# Altium schematic sheet Power-Supply.SchDoc
size A4; SheetNumber: 1; SheetTotal: 6
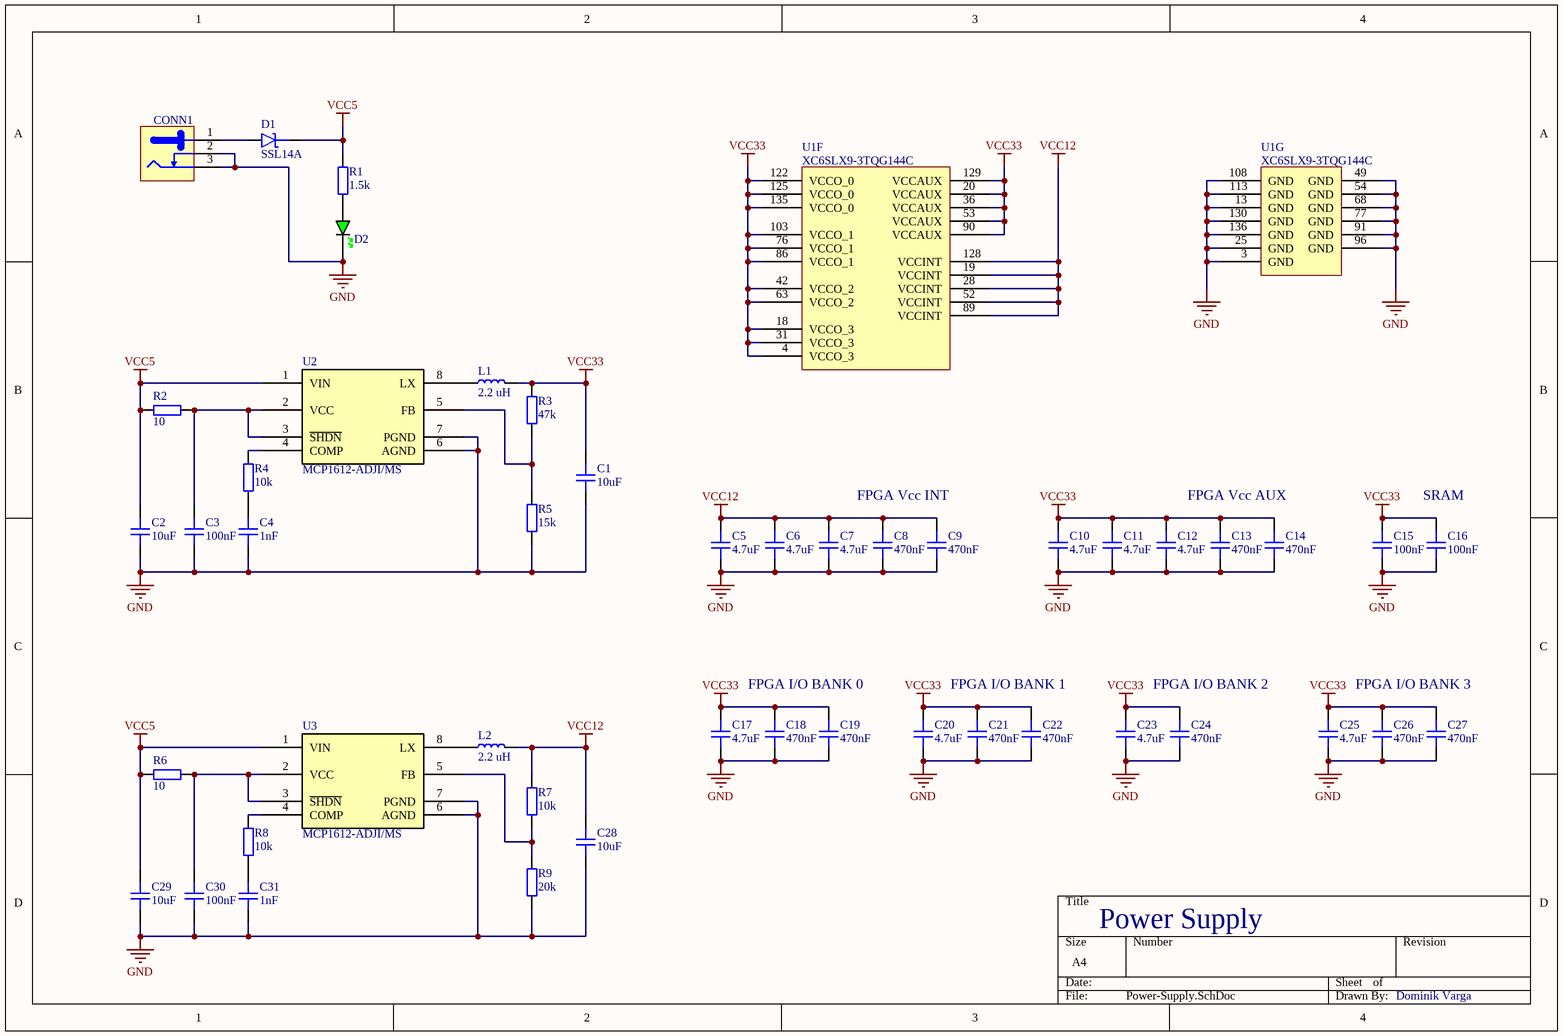
[diagram p0: Power-Supply.SchDoc]

## Parts
C1  10uF  [CAP_SMD1210]
C2  10uF  [CAP_SMD1210]
C3  100nF  [CAP_SMD0603]
C4  1nF  [CAP_SMD0603]
C5  4.7uF  [CAP_SMD0603]
C6  4.7uF  [CAP_SMD0603]
C7  4.7uF  [CAP_SMD0603]
C8  470nF  [CAP_SMD0603]
C9  470nF  [CAP_SMD0603]
C10  4.7uF  [CAP_SMD0603]
C11  4.7uF  [CAP_SMD0603]
C12  4.7uF  [CAP_SMD0603]
C13  470nF  [CAP_SMD0603]
C14  470nF  [CAP_SMD0603]
C15  100nF  [CAP_SMD0603]
C16  100nF  [CAP_SMD0603]
C17  4.7uF  [CAP_SMD0603]
C18  470nF  [CAP_SMD0603]
C19  470nF  [CAP_SMD0603]
C20  4.7uF  [CAP_SMD0603]
C21  470nF  [CAP_SMD0603]
C22  470nF  [CAP_SMD0603]
C23  4.7uF  [CAP_SMD0603]
C24  470nF  [CAP_SMD0603]
C25  4.7uF  [CAP_SMD0603]
C26  470nF  [CAP_SMD0603]
C27  470nF  [CAP_SMD0603]
C28  10uF  [CAP_SMD1210]
C29  10uF  [CAP_SMD1210]
C30  100nF  [CAP_SMD0603]
C31  1nF  [CAP_SMD0603]
CONN1  DC_PWR  [DC_PWR_CONN]  (value not drawn)
D1  SSL14A  [DIOM5226X230N]
D2  GREEN  [LED_G_SMD0603]  (value not drawn)
L1  2.2 uH  [SDR0604]
L2  2.2 uH  [SDR0604]
R1  1.5k  [RES_SMD0603]
R2  10  [RES_SMD0603]
R3  47k  [RES_SMD0603]
R4  10k  [RES_SMD0603]
R5  15k  [RES_SMD0603]
R6  10  [RES_SMD0603]
R7  10k  [RES_SMD0603]
R8  10k  [RES_SMD0603]
R9  20k  [RES_SMD0603]
U1  XC6SLX9-3TQG144C  [QFP50P2200X2200X160-144N]  (parts F,G of 7)
U2  MCP1612-ADJI/MS  [SOP65P490X109-8N]
U3  MCP1612-ADJI/MS  [SOP65P490X109-8N]

## Nets
GND: C1.1 C2.1 C3.1 C4.1 C5.1 C6.1 C7.1 C8.1 C9.1 C10.1 C11.1 C12.1 C13.1 C14.1 C15.1 C16.1 C17.1 C18.1 C19.1 C20.1 C21.1 C22.1 C23.1 C24.1 C25.1 C26.1 C27.1 C28.1 C29.1 C30.1 C31.1 CONN1.2 CONN1.3 D2.2(K) R5.1 R9.1 U1.3(GND) U1.13(GND) U1.25(GND) U1.49(GND) U1.54(GND) U1.68(GND) U1.77(GND) U1.91(GND) U1.96(GND) U1.108(GND) U1.113(GND) U1.130(GND) U1.136(GND) U2.6(AGND) U2.7(PGND) U3.6(AGND) U3.7(PGND)
VCC5: C2.2 C29.2 D1.1(K) R1.2 R2.1 R6.1 U2.1(VIN) U3.1(VIN)
VCC12: C5.2 C6.2 C7.2 C8.2 C9.2 C28.2 L2.2 R7.2 U1.19(VCCINT) U1.28(VCCINT) U1.52(VCCINT) U1.89(VCCINT) U1.128(VCCINT)
VCC33: C1.2 C10.2 C11.2 C12.2 C13.2 C14.2 C15.2 C16.2 C17.2 C18.2 C19.2 C20.2 C21.2 C22.2 C23.2 C24.2 C25.2 C26.2 C27.2 L1.2 R3.2 U1.4(VCCO_3) U1.18(VCCO_3) U1.20(VCCAUX) U1.31(VCCO_3) U1.36(VCCAUX) U1.42(VCCO_2) U1.53(VCCAUX) U1.63(VCCO_2) U1.76(VCCO_1) U1.86(VCCO_1) U1.90(VCCAUX) U1.103(VCCO_1) U1.122(VCCO_0) U1.125(VCCO_0) U1.129(VCCAUX) U1.135(VCCO_0)
NetC3_2: C3.2 R2.2 U2.2(VCC) U2.3(~{SHDN})
NetC4_2: C4.2 R4.1
NetC30_2: C30.2 R6.2 U3.2(VCC) U3.3(~{SHDN})
NetC31_2: C31.2 R8.1
NetCONN1_1: CONN1.1 D1.2(A)
NetD2_1: D2.1(A) R1.1
NetL1_1: L1.1 U2.8(LX)
NetL2_1: L2.1 U3.8(LX)
NetR3_1: R3.1 R5.2 U2.5(FB)
NetR4_2: R4.2 U2.4(COMP)
NetR7_1: R7.1 R9.2 U3.5(FB)
NetR8_2: R8.2 U3.4(COMP)

## Notes on the sheet
- FPGA Vcc INT
- FPGA Vcc AUX
- (near C16) SRAM
- FPGA I/O BANK 0
- FPGA I/O BANK 1
- FPGA I/O BANK 2
- FPGA I/O BANK 3
- Power Supply
- Dominik Varga

## Library data of the parts
C1 C2 C28 C29 = CAP_1210: Capacitor SMD 1210
C3-C27 C30 C31 = CAP_0603: Capacitor SMD 0603
CONN1 = DC_PWR: 12V /  5A, 2.1mm Diameter Pin, DC Power Socket With  Switch. DC10A Type
D1 = SSL14A: Schottky Barrier Diode SSL14A
D2 = LED_0603_GREEN: LED 0603 GREEN SMD
L1 L2 = SDR0604: Inductor SDR0604
R1-R9 = RES_0603: Resistor SMD 0603
U1 = XC6SLX9-3TQG144C: Spartan-6 LX 1.2V FPGA, 102 User I/Os, 144-Pin TQFP (0.5mm Pitch), Speed Grade 3, Industrial Grade, Pb-Free
U2 U3 = MCP1612-ADJI/MS: Single 1A Synchronous Buck Regulator, 1.4MHz, 8-Pin MSOP, Industrial Temperature; Mfr_Name: Microchip; Copyright: Copyright (C) 2023 Ultra Librarian. All rights reserved.; Manufacturer_Part_Number: MCP1612-ADJI/MS; RefDes: RefDes; Type: DEV